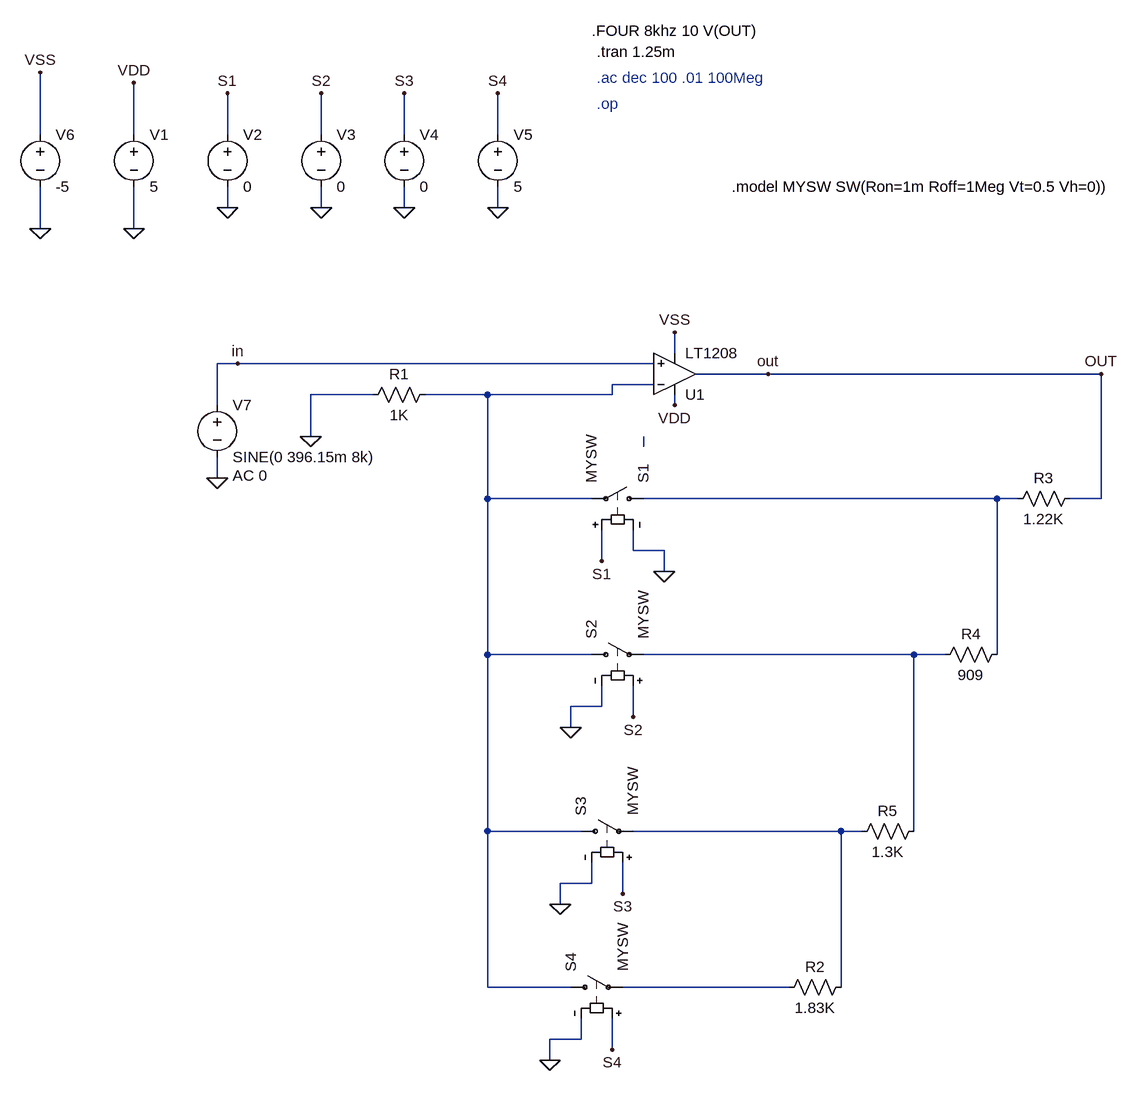
[diagram p0: schematic ETAJ 3 PGA transient cu sw ideale.asc]
ETAJ 3 PGA transient cu sw ideale.asc, the LTspice schematic file:
Version 4
SHEET 1 1676 1164
WIRE -704 -320 -704 -416
WIRE -560 -320 -560 -400
WIRE -416 -320 -416 -384
WIRE -272 -320 -272 -384
WIRE -144 -320 -144 -384
WIRE 0 -320 0 -384
WIRE -416 -208 -416 -240
WIRE -272 -208 -272 -240
WIRE -144 -208 -144 -240
WIRE 0 -208 0 -240
WIRE -704 -176 -704 -240
WIRE -560 -176 -560 -240
WIRE 272 16 272 -16
WIRE -400 32 -432 32
WIRE 240 32 -400 32
WIRE 416 48 304 48
WIRE 928 48 416 48
WIRE 240 64 176 64
WIRE -192 80 -288 80
WIRE -16 80 -112 80
WIRE 176 80 176 64
WIRE 176 80 -16 80
WIRE -432 96 -432 32
WIRE 272 96 272 80
WIRE -288 144 -288 80
WIRE 224 160 224 144
WIRE -432 208 -432 176
WIRE -16 240 -16 80
WIRE 144 240 -16 240
WIRE 768 240 224 240
WIRE 800 240 768 240
WIRE 928 240 928 48
WIRE 928 240 880 240
WIRE 208 320 208 288
WIRE 256 320 208 320
WIRE 160 336 160 288
WIRE 256 352 256 320
WIRE -16 480 -16 240
WIRE 144 480 -16 480
WIRE 640 480 224 480
WIRE 688 480 640 480
WIRE 768 480 768 240
WIRE 160 560 160 528
WIRE 160 560 112 560
WIRE 208 576 208 528
WIRE 112 592 112 560
WIRE -16 752 -16 480
WIRE 128 752 -16 752
WIRE 528 752 208 752
WIRE 560 752 528 752
WIRE 640 752 640 480
WIRE 144 832 144 800
WIRE 144 832 96 832
WIRE 192 848 192 800
WIRE 96 864 96 832
WIRE -16 992 -16 752
WIRE 112 992 -16 992
WIRE 448 992 192 992
WIRE 528 992 528 752
WIRE 128 1072 128 1040
WIRE 128 1072 80 1072
WIRE 176 1088 176 1040
WIRE 80 1104 80 1072
FLAG -560 -176 0
FLAG -560 -400 VDD
FLAG -416 -208 0
FLAG -416 -384 S1
FLAG -272 -208 0
FLAG -272 -384 S2
FLAG -144 -208 0
FLAG -144 -384 S3
FLAG 0 -208 0
FLAG 0 -384 S4
FLAG -704 -176 0
FLAG -704 -416 VSS
FLAG -432 208 0
FLAG -288 144 0
FLAG 416 48 out
FLAG 272 96 VDD
FLAG 272 -16 VSS
FLAG 928 48 OUT
FLAG -400 32 in
FLAG 160 336 S1
FLAG 256 352 0
FLAG 208 576 S2
FLAG 112 592 0
FLAG 192 848 S3
FLAG 96 864 0
FLAG 176 1088 S4
FLAG 80 1104 0
DATAFLAG 64 80 ""
DATAFLAG 672 48 ""
DATAFLAG 896 48 ""
SYMBOL voltage -560 -336 R0
WINDOW 123 0 0 Left 2
WINDOW 39 0 0 Left 2
SYMATTR InstName V1
SYMATTR Value 5
SYMBOL voltage -416 -336 R0
WINDOW 123 0 0 Left 2
WINDOW 39 0 0 Left 2
SYMATTR InstName V2
SYMATTR Value 0
SYMBOL voltage -272 -336 R0
WINDOW 123 0 0 Left 2
WINDOW 39 0 0 Left 2
SYMATTR InstName V3
SYMATTR Value 0
SYMBOL voltage -144 -336 R0
WINDOW 123 0 0 Left 2
WINDOW 39 0 0 Left 2
SYMATTR InstName V4
SYMATTR Value 0
SYMBOL voltage 0 -336 R0
WINDOW 123 0 0 Left 2
WINDOW 39 0 0 Left 2
SYMATTR InstName V5
SYMATTR Value 5
SYMBOL voltage -704 -336 R0
WINDOW 123 0 0 Left 2
WINDOW 39 0 0 Left 2
SYMATTR InstName V6
SYMATTR Value -5
SYMBOL voltage -432 80 R0
WINDOW 123 24 124 Left 2
WINDOW 39 0 0 Left 2
SYMATTR Value2 AC 0
SYMATTR InstName V7
SYMATTR Value SINE(0 396.15m 8k)
SYMBOL res -96 64 R90
WINDOW 0 0 56 VBottom 2
WINDOW 3 32 56 VTop 2
SYMATTR InstName R1
SYMATTR Value 1K
SYMBOL OpAmps\\LT1208 272 112 M180
SYMATTR InstName U1
SYMBOL res 544 976 R90
WINDOW 0 0 56 VBottom 2
WINDOW 3 32 56 VTop 2
SYMATTR InstName R2
SYMATTR Value 1.83K
SYMBOL res 896 224 R90
WINDOW 0 0 56 VBottom 2
WINDOW 3 32 56 VTop 2
SYMATTR InstName R3
SYMATTR Value 1.22K
SYMBOL res 784 464 R90
WINDOW 0 0 56 VBottom 2
WINDOW 3 32 56 VTop 2
SYMATTR InstName R4
SYMATTR Value 909
SYMBOL res 656 736 R90
WINDOW 0 0 56 VBottom 2
WINDOW 3 32 56 VTop 2
SYMATTR InstName R5
SYMATTR Value 1.3K
SYMBOL sw 240 240 M270
SYMATTR InstName S1
SYMATTR Value MYSW
SYMBOL sw 128 480 R270
SYMATTR InstName S2
SYMATTR Value MYSW
SYMBOL sw 112 752 R270
SYMATTR InstName S3
SYMATTR Value MYSW
SYMBOL sw 96 992 R270
SYMATTR InstName S4
SYMATTR Value MYSW
TEXT 152 -408 Left 2 ;.ac dec 100 .01 100Meg
TEXT 152 -368 Left 2 ;.op
TEXT 152 -448 Left 2 !.tran 1.25m
TEXT 144 -480 Left 2 !.FOUR 8khz 10 V(OUT)
TEXT 360 -240 Left 2 !.model MYSW SW(Ron=1m Roff=1Meg Vt=0.5 Vh=0))

The netlist it stands for:
* ETAJ 3 PGA transient cu sw ideale.asc
V1 VDD 0 5
V2 S1 0 0
V3 S2 0 0
V4 S3 0 0
V5 S4 0 5
V6 VSS 0 -5
V7 in 0 SINE(0 396.15m 8k) AC 0
R1 N001 0 1K
XU1 in N001 VDD VSS out LT1208  ; pins In+ In- V+ V- OUT
R2 N005 N006 1.83K
R3 out N003 1.22K
R4 N003 N004 909
R5 N004 N005 1.3K
S1 N003 N001 S1 0 MYSW
S2 N001 N004 S2 0 MYSW
S3 N001 N005 S3 0 MYSW
S4 N001 N006 S4 0 MYSW
* .ac dec 100 .01 100Meg
* .op
.tran 1.25m
.FOUR 8khz 10 V(OUT)
.model MYSW SW(Ron=1m Roff=1Meg Vt=0.5 Vh=0))
.backanno
.end